# EAGLE design phantom preamp (EAGLE 9.6.2)
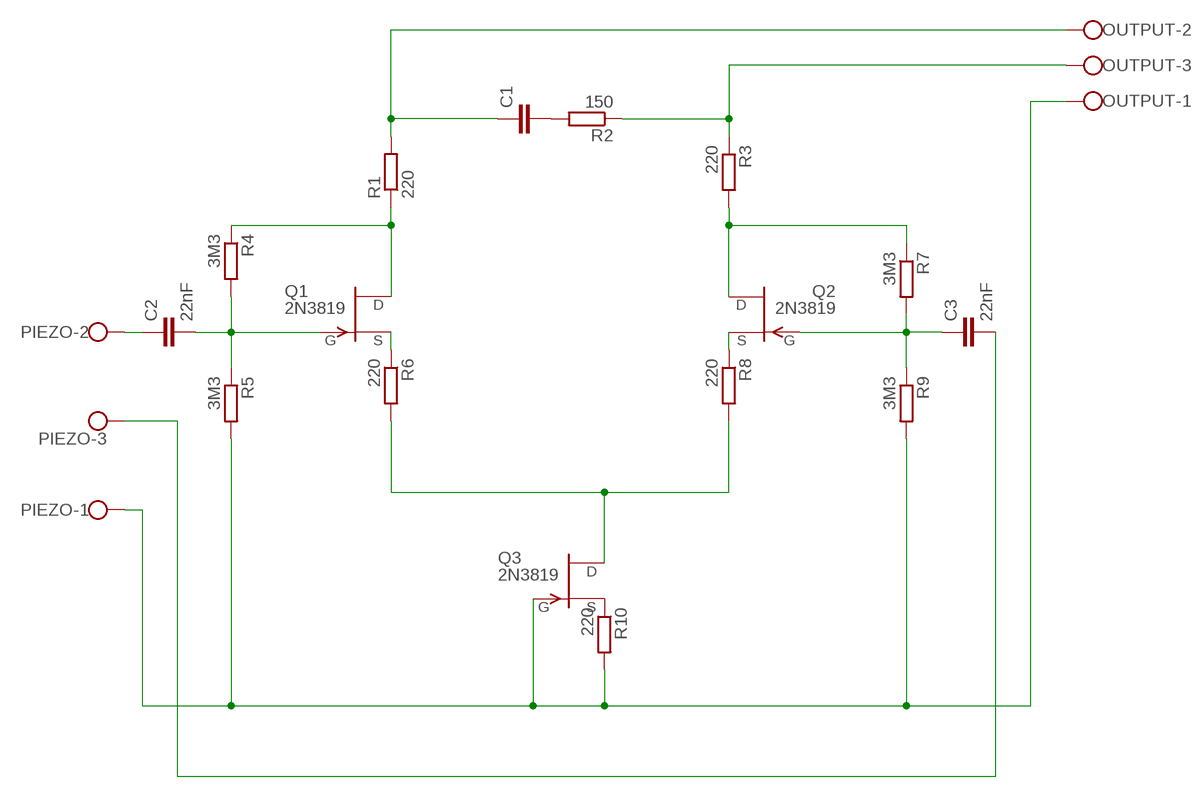
[diagram p0: schematic, sheet 1]

## Parts
C1  C-EU050-024X044  [C050-024X044]
C2  22nF  C-EU050-024X044  [C050-024X044]
C3  22nF  C-EU050-024X044  [C050-024X044]
OUTPUT  W237-103  [W237-103]
PIEZO  W237-103  [W237-103]
Q1  2N3819  [TO92]
Q2  2N3819  [TO92]
Q3  2N3819  [TO92]
R1  220  R-EU_0207/2V  [0207/2V]
R2  150  R-EU_0207/2V  [0207/2V]
R3  220  R-EU_0207/2V  [0207/2V]
R4  3M3  R-EU_0207/2V  [0207/2V]
R5  3M3  R-EU_0207/2V  [0207/2V]
R6  220  R-EU_0207/2V  [0207/2V]
R7  3M3  R-EU_0207/2V  [0207/2V]
R8  220  R-EU_0207/2V  [0207/2V]
R9  3M3  R-EU_0207/2V  [0207/2V]
R10  220  R-EU_0207/2V  [0207/2V]

## Nets
N$1: C2.2 Q1.2(G) R4.2 R5.1
N$2: Q1.3(S) R6.1
N$3: Q2.3(S) R8.1
N$4: Q3.3(S) R10.1
N$5: C3.1 Q2.2(G) R7.2 R9.1
N$6: C1.2 R2.2
N$7: C2.1 PIEZO.2
N$8: Q3.1(D) R6.2 R8.2
N$9: OUTPUT.1 PIEZO.1 Q3.2(G) R5.2 R9.2 R10.2
N$10: C3.2 PIEZO.3
N$11: Q1.1(D) R1.1 R4.1
N$12: Q2.1(D) R3.2 R7.1
N$13: C1.1 OUTPUT.2 R1.2
N$14: OUTPUT.3 R2.1 R3.1

## Library data of the parts
C1-C3 = rcl:C-EU: CAPACITOR, European symbol; SPICEPREFIX: C
OUTPUT PIEZO = con-wago-500:W237-103: WAGO SCREW CLAMP; MPN: 237-103; OC_FARNELL: unknown; OC_NEWARK: 18M7116
Q1-Q3 = transistor-fet:2N3819: N-Channel Junction FET
R1-R10 = rcl:R-EU_: RESISTOR, European symbol; SPICEPREFIX: R

## Board
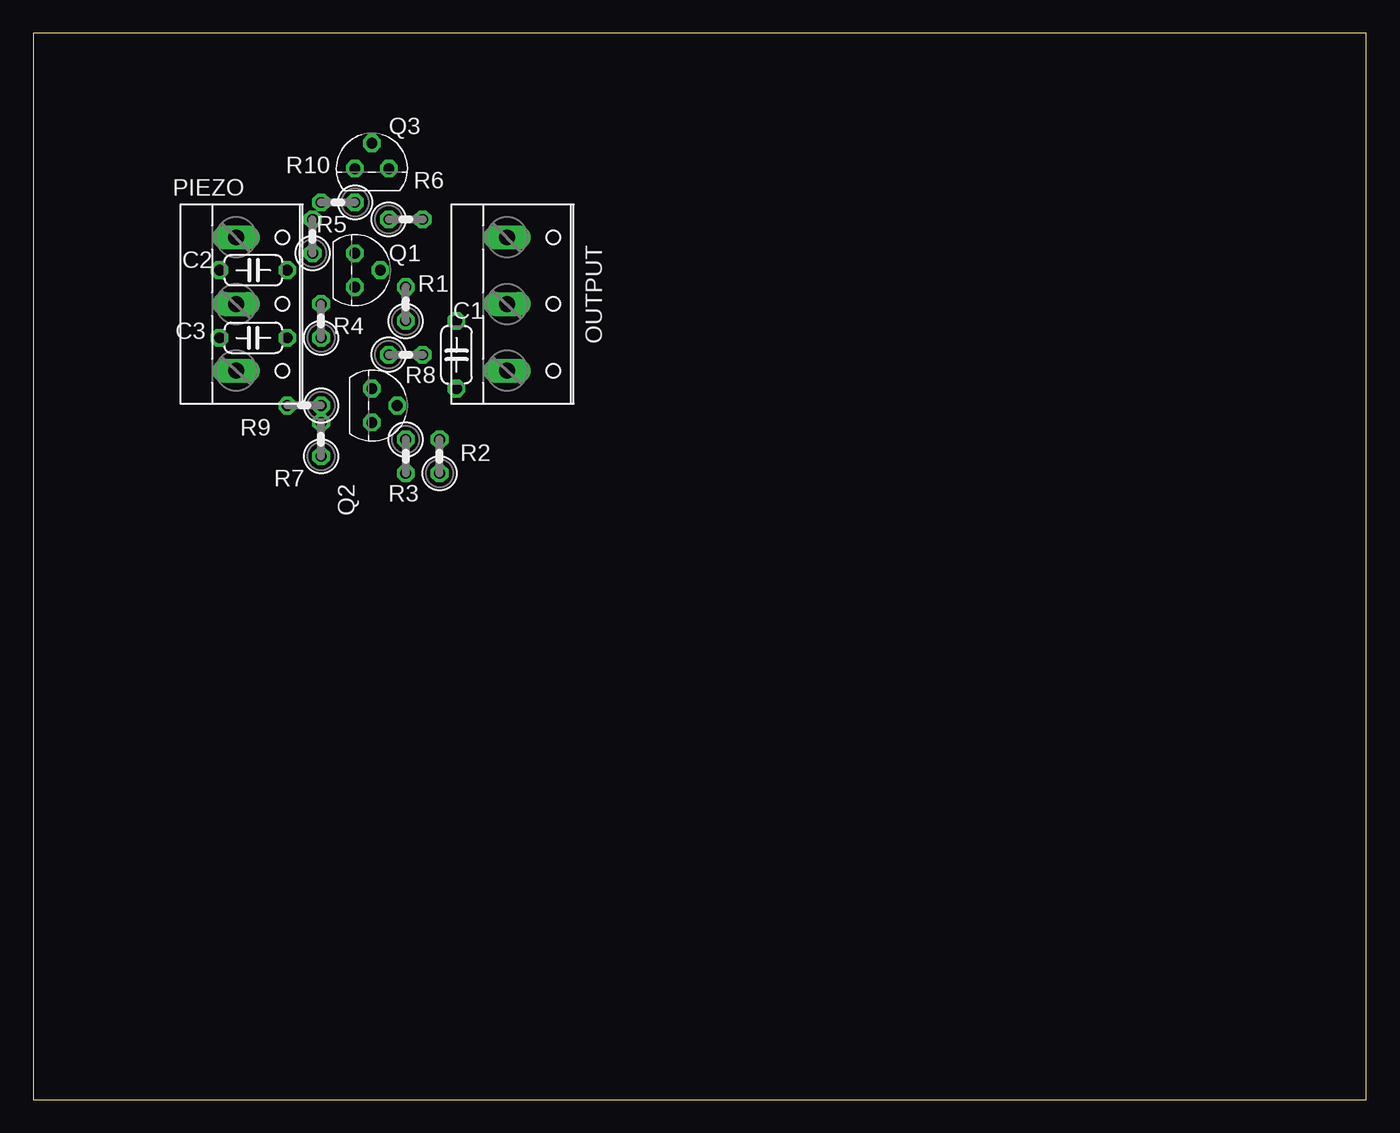
[diagram p1: board, top side]
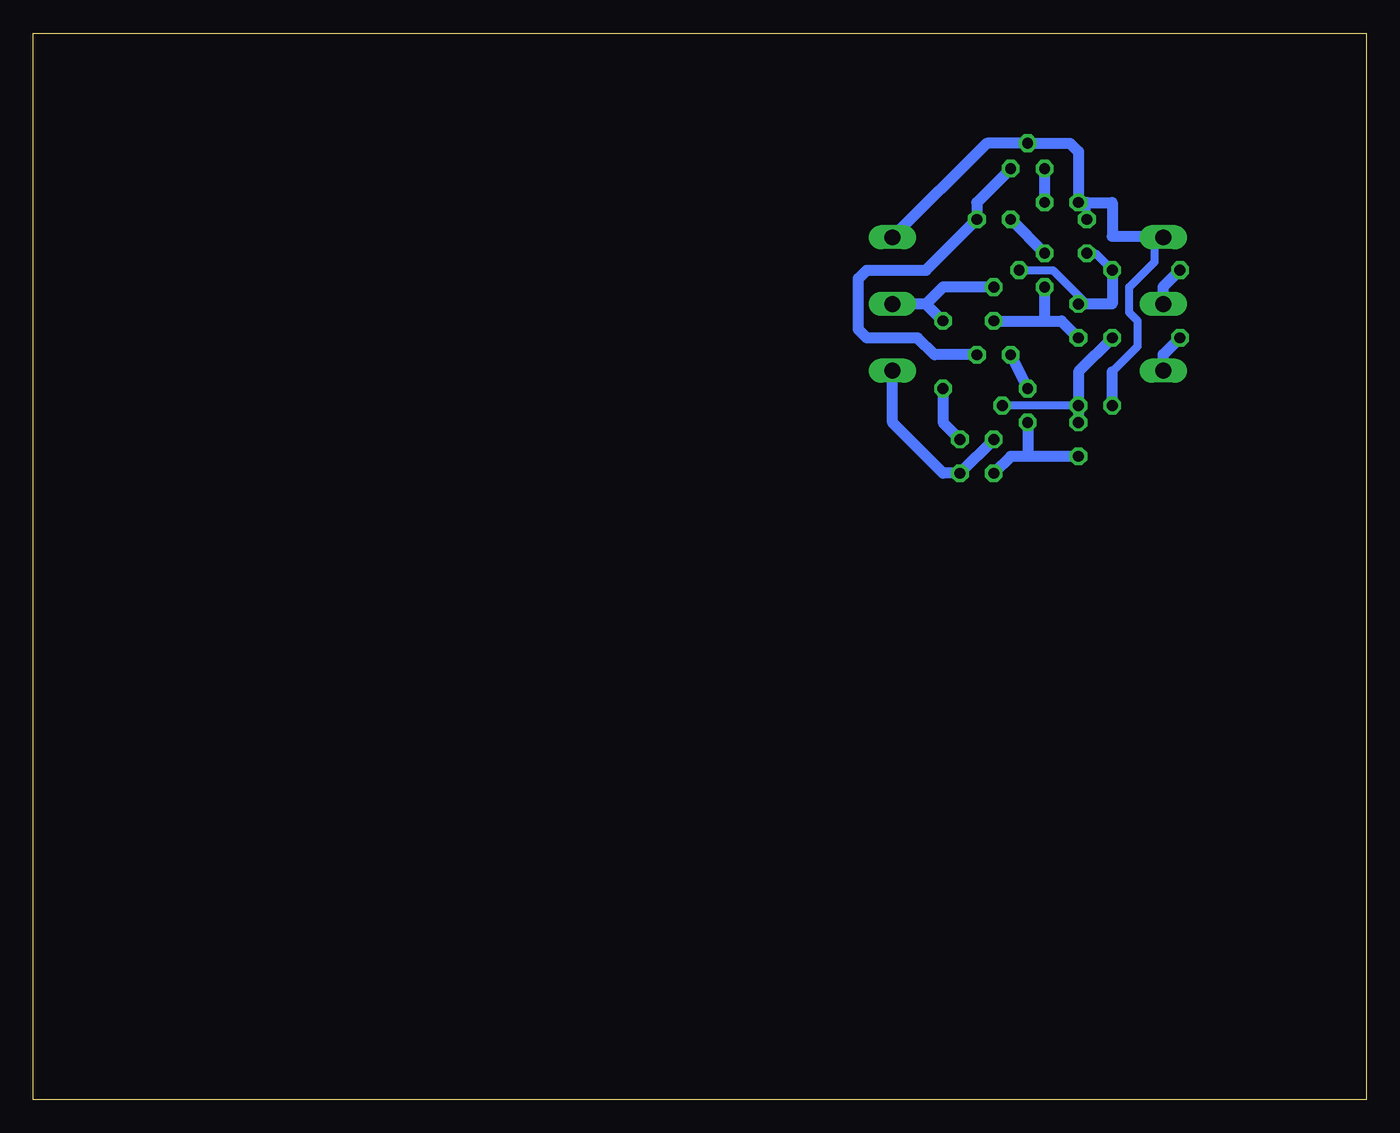
[diagram p2: board, bottom side, seen from below]

Size 100 x 80 mm. Coordinates in mm from the lower left corner, seen from the top.
Outline: 0,0 100,0 100,80 0,80 0,0
Copper layers (1*16): Top 0.035mm / dielectric 1.5mm / Bottom 0.035mm
Design rules "default": minimum track width 6mil, minimum drill 0.35mm, track to track 6mil, track to pad 6mil, pad to pad 6mil, via to via 6mil, smd to smd 6mil, copper to edge 40mil, drill to drill 6mil, minimum pad ring 10mil, minimum via ring 8mil, stop-mask expansion 4mil, vias tented up to drill 0mil, thermal gap 10mil

### Footprints (pad centres in the part's own frame; a part is rotated, then mirrored left to right if it is on the bottom)
C050-024X044 = drill 0.813 octagon: 1 -2.54,0; 2 2.54,0
W237-103 = drill 1.194 long: 1 -5,-1.29; 2 0,-1.29; 3 5,-1.29
TO92 = drill 0.813 octagon: 1 1.27,0; 2 0,1.905; 3 -1.27,0
0207/2V = drill 0.813 octagon: 1 -1.27,0; 2 1.27,0

### Placement (x,y rotation side)
C1  31.75,55.88 270 top
C2  16.51,62.23 0 top
C3  16.51,57.15 180 top
OUTPUT  36.83,59.69 270 top
PIEZO  16.51,59.69 270 top
Q1  24.13,62.23 270 top
Q2  25.4,52.07 270 top
Q3  25.4,69.85 0 top
R1  27.94,59.69 90 top
R2  30.48,48.26 90 top
R3  27.94,48.26 270 top
R4  21.59,58.42 90 top
R5  20.95,64.77 90 top
R6  27.94,66.04 0 top
R7  21.59,49.53 90 top
R8  27.94,55.88 0 top
R9  20.32,52.07 180 top
R10  22.86,67.31 180 top

### Tracks (layer width: path | path; a pad name or v marks a point on that pad's centre or on a via)
N$1
  Bottom 0.61: Q1.2 23.5,62.23 20.95,59.69 | C2.2 20.32,63.5 R5.1
  Bottom 0.813: C2.2 19.05,59.69 20.95,59.69 R4.2
N$2
  Bottom 0.813: R6.1 Q1.3
N$3
  Bottom 0.813: Q2.3 R8.1
N$4
  Bottom 0.813: Q3.3 R10.1
N$5
  Bottom 0.61: R9.1 Q2.2
  Bottom 0.813: R7.2 R9.1 21.59,54.61 C3.1
N$6
  Bottom 0.813: R2.2 31.75,50.8 C1.2
N$7
  Bottom 0.813: PIEZO.2 15.22,60.98 C2.1
N$8
  Bottom 0.813: Q3.1 29.21,67.31 R6.2 33.02,62.23 37.47,62.23 38.1,61.59 38.1,57.78 37.47,57.15 33.66,57.15 32.38,55.88 R8.2
N$9
  Bottom 0.61: 19.05,54.61 17.14,56.52 17.14,58.42 17.78,59.05 17.78,60.96 15.88,62.87 15.88,64.77 | R5.2 20.95,67.31
  Bottom 0.813: PIEZO.1 15.3,64.77 15.88,64.77 19.05,64.77 19.05,67.31 20.95,67.31 R10.2 21.59,71.12 22.23,71.75 Q3.2 28.48,71.75 OUTPUT.1 | R9.2 19.05,54.61
N$10
  Bottom 0.813: PIEZO.3 15.22,55.9 C3.2
N$11
  Bottom 0.813: R4.1 22.86,58.42 24.13,58.42 | R1.1 24.13,58.42 | Q1.1 24.13,58.42
N$12
  Bottom 0.813: R3.2 26.67,48.26 25.4,48.26 | R7.1 25.4,48.26 | Q2.1 25.4,48.26
N$13
  Bottom 0.813: C1.1 33.02,59.69 | 33.02,59.69 OUTPUT.2 35.56,59.69 | R1.2 31.75,60.96 33.02,59.69
N$14
  Bottom 0.813: R3.1 R2.1 31.75,46.99 35.54,50.78 OUTPUT.3